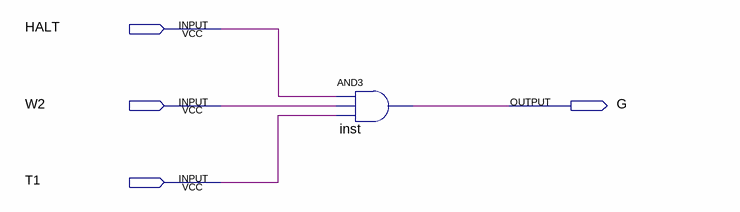
[diagram p0: schematic sheet]
// Quartus schematic G.bdf as structural Verilog: 1 symbols, 4 pins
module G (
  input  HALT,
  input  W2,
  input  T1,
  output G
);

  and inst (G, HALT, W2, T1);
endmodule
